# EAGLE design ABMS - VFG - POWER (EAGLE 5.10)
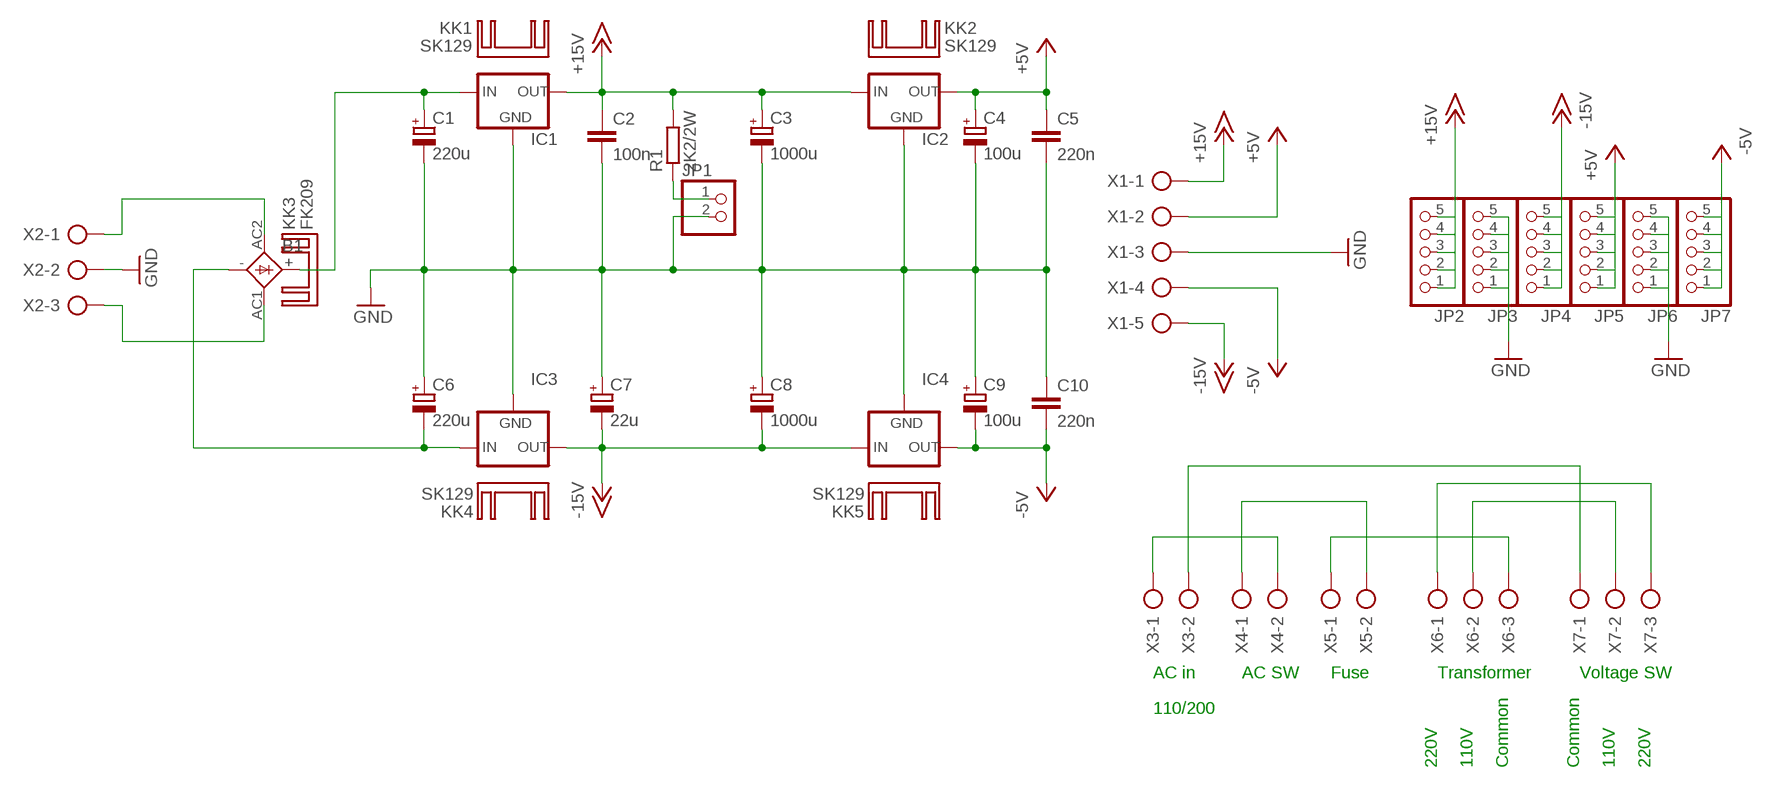
[diagram p0: schematic, sheet 1]

## Parts
B1  GBU4  [GBU4S]
C1  220u  CPOL-EUE5-8.5  [E5-8,5]
C2  100n  C-EU075-032X103  [C075-032X103]
C3  1000u  CPOL-EUE10-20  [EB20D]
C4  100u  CPOL-EUE5-8.5  [E5-8,5]
C5  220n  C-EU075-032X103  [C075-032X103]
C6  220u  CPOL-EUE5-8.5  [E5-8,5]
C7  22u  CPOL-EUE5-8.5  [E5-8,5]
C8  1000u  CPOL-EUE10-20  [EB20D]
C9  100u  CPOL-EUE5-8.5  [E5-8,5]
C10  220n  C-EU075-032X103  [C075-032X103]
IC1  78XXS  [78XXS]
IC2  78XXS  [78XXS]
IC3  79XXS  [79XXS]
IC4  79XXS  [79XXS]
JP1  PINHD-1X2  [1X02]
JP2  PINHD-1X5  [1X05]
JP3  PINHD-1X5  [1X05]
JP4  PINHD-1X5  [1X05]
JP5  PINHD-1X5  [1X05]
JP6  PINHD-1X5  [1X05]
JP7  PINHD-1X5  [1X05]
KK1  SK129  [SK129-HOLE]
KK2  SK129  [SK129-HOLE]
KK3  FK209  [FK209]
KK4  SK129  [SK129-HOLE]
KK5  SK129  [SK129-HOLE]
R1  2K2/2W  R-EU_0207/10  [0207/10]
X1  AK300/5  [AK300/5]
X2  AK300/3  [AK300/3]
X3  AK300/2  [AK300/2]
X4  AK300/2  [AK300/2]
X5  AK300/2  [AK300/2]
X6  AK300/3  [AK300/3]
X7  AK300/3  [AK300/3]

## Nets
+5V: C4.+ C5.1 IC2.OUT JP5.1 JP5.2 JP5.3 JP5.4 JP5.5 X1.2
+15V: C2.1 C3.+ IC1.OUT IC2.IN JP2.1 JP2.2 JP2.3 JP2.4 JP2.5 R1.2 X1.1
-5V: C9.- C10.2 IC4.OUT JP7.1 JP7.2 JP7.3 JP7.4 JP7.5 X1.4
-15V: C7.- C8.- IC3.OUT IC4.IN JP4.1 JP4.2 JP4.3 JP4.4 JP4.5 X1.5
GND: C1.- C2.2 C3.- C4.- C5.2 C6.+ C7.+ C8.+ C9.+ C10.1 IC1.GND IC2.GND IC3.GND IC4.GND JP1.2 JP3.1 JP3.2 JP3.3 JP3.4 JP3.5 JP6.1 JP6.2 JP6.3 JP6.4 JP6.5 X1.3 X2.2
N$1: B1.AC2(AC1) X2.1
N$2: B1.AC1(AC2) X2.3
N$3: B1.+ C1.+ IC1.IN
N$4: B1.- C6.- IC3.IN
N$5: X3.1 X4.2
N$6: X4.1 X5.2
N$7: X5.1 X6.3
N$8: X3.2 X7.1
N$9: X6.1 X7.3
N$10: X6.2 X7.2
N$12: JP1.1 R1.1

## Notes on the sheet
- AC in | AC SW | Fuse | Transformer | Voltage SW
- 110/200
- 220V | 110V | Common | Common | 110V | 220V

## Library data of the parts
B1 = rectifier:GBU4: GENERAL INSTRUMENT RECTIFIER
C1 C3 C4 C6-C9 = resistor:CPOL-EU: POLARIZED CAPACITOR, European symbol
C2 C5 C10 = resistor:C-EU: CAPACITOR, European symbol
IC1 IC2 = v-reg:78XXS: VOLTAGE REGULATOR
IC3 IC4 = v-reg:79XXS: VOLTAGE REGULATOR
JP1 = pinhead:PINHD-1X2: PIN HEADER
JP2-JP7 = pinhead:PINHD-1X5: PIN HEADER
KK1 KK2 KK4 KK5 = heatsink:SK129: HEATSINK manufacturer Fischer/distributor Buerklin
KK3 = heatsink:FK209: HEATSINK manufacturer Fischer/distributor Buerklin
R1 = resistor:R-EU_: RESISTOR, European symbol
X1 = con-ptr500:AK300/5: CONNECTOR
X2 X6 X7 = con-ptr500:AK300/3: CONNECTOR
X3-X5 = con-ptr500:AK300/2: CONNECTOR

## Net classes
0 default: width 0.635 mm, drill 0.889 mm, clearance 0.635 mm

## Board
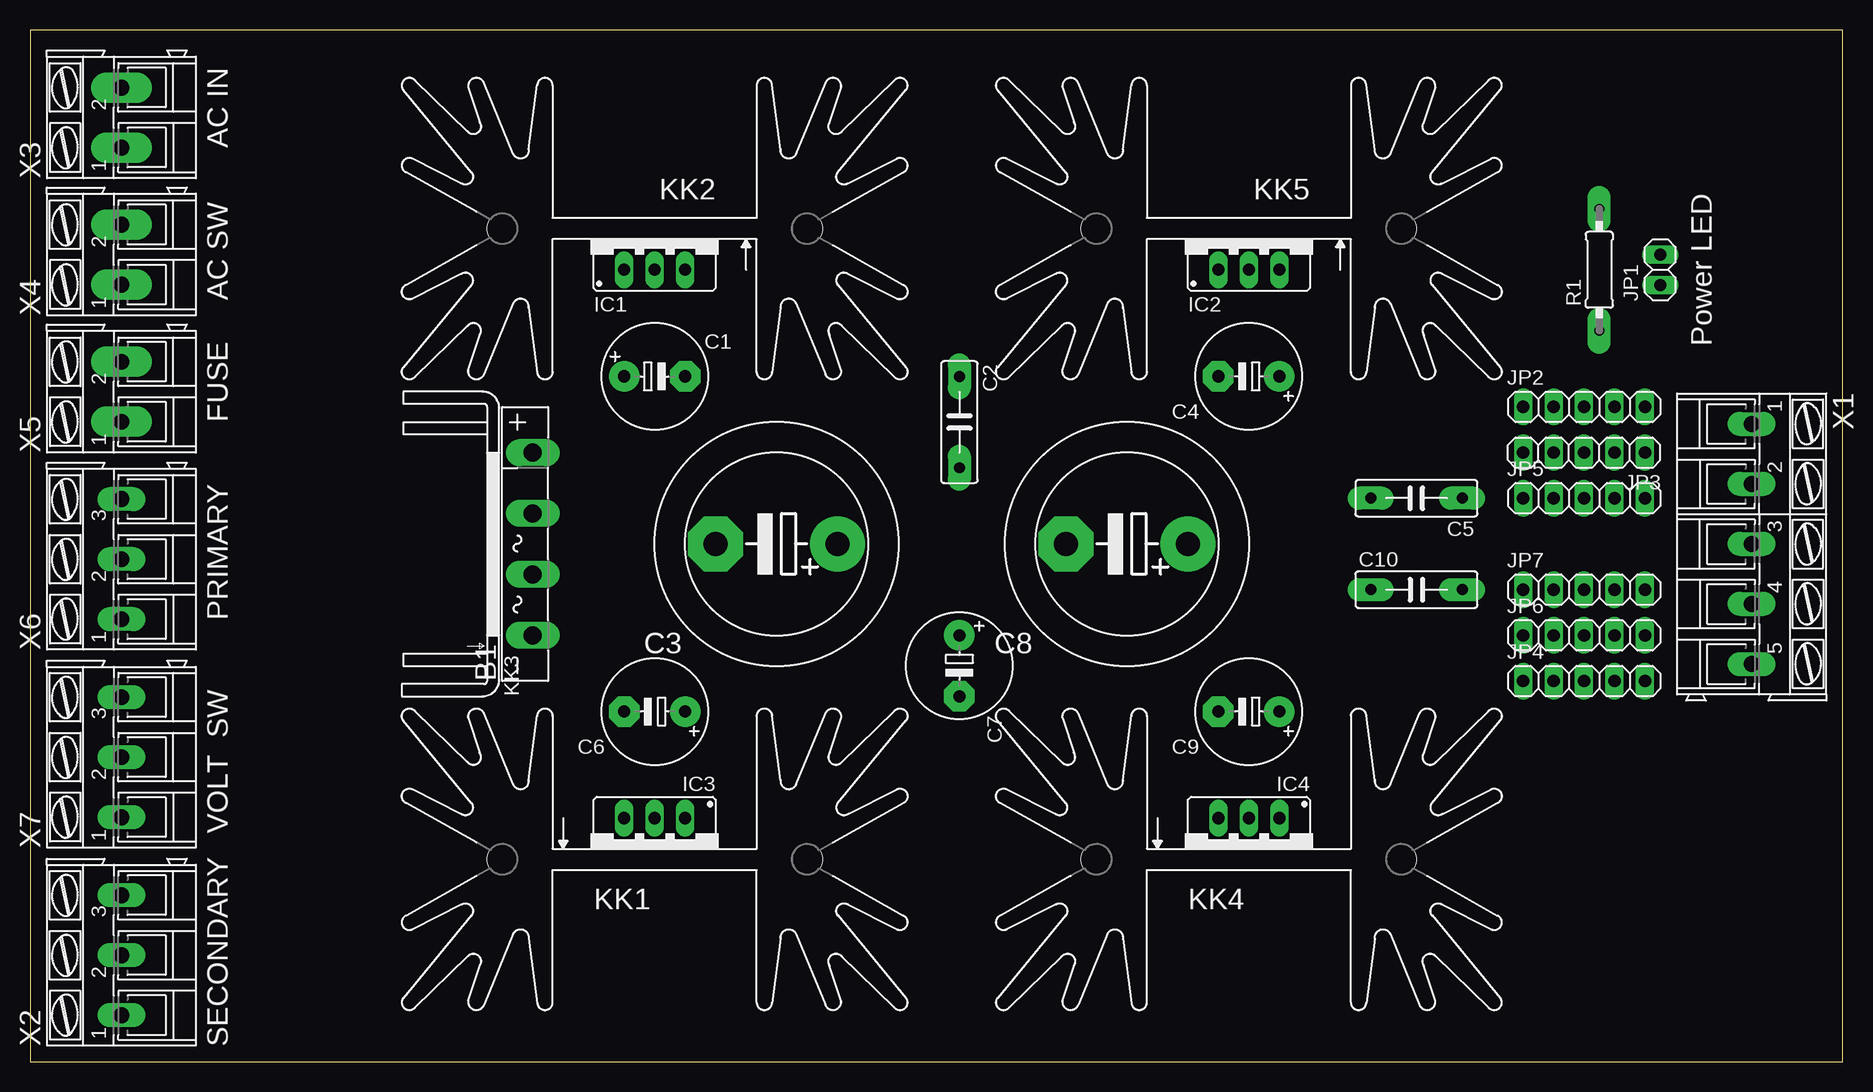
[diagram p1: board, top side]
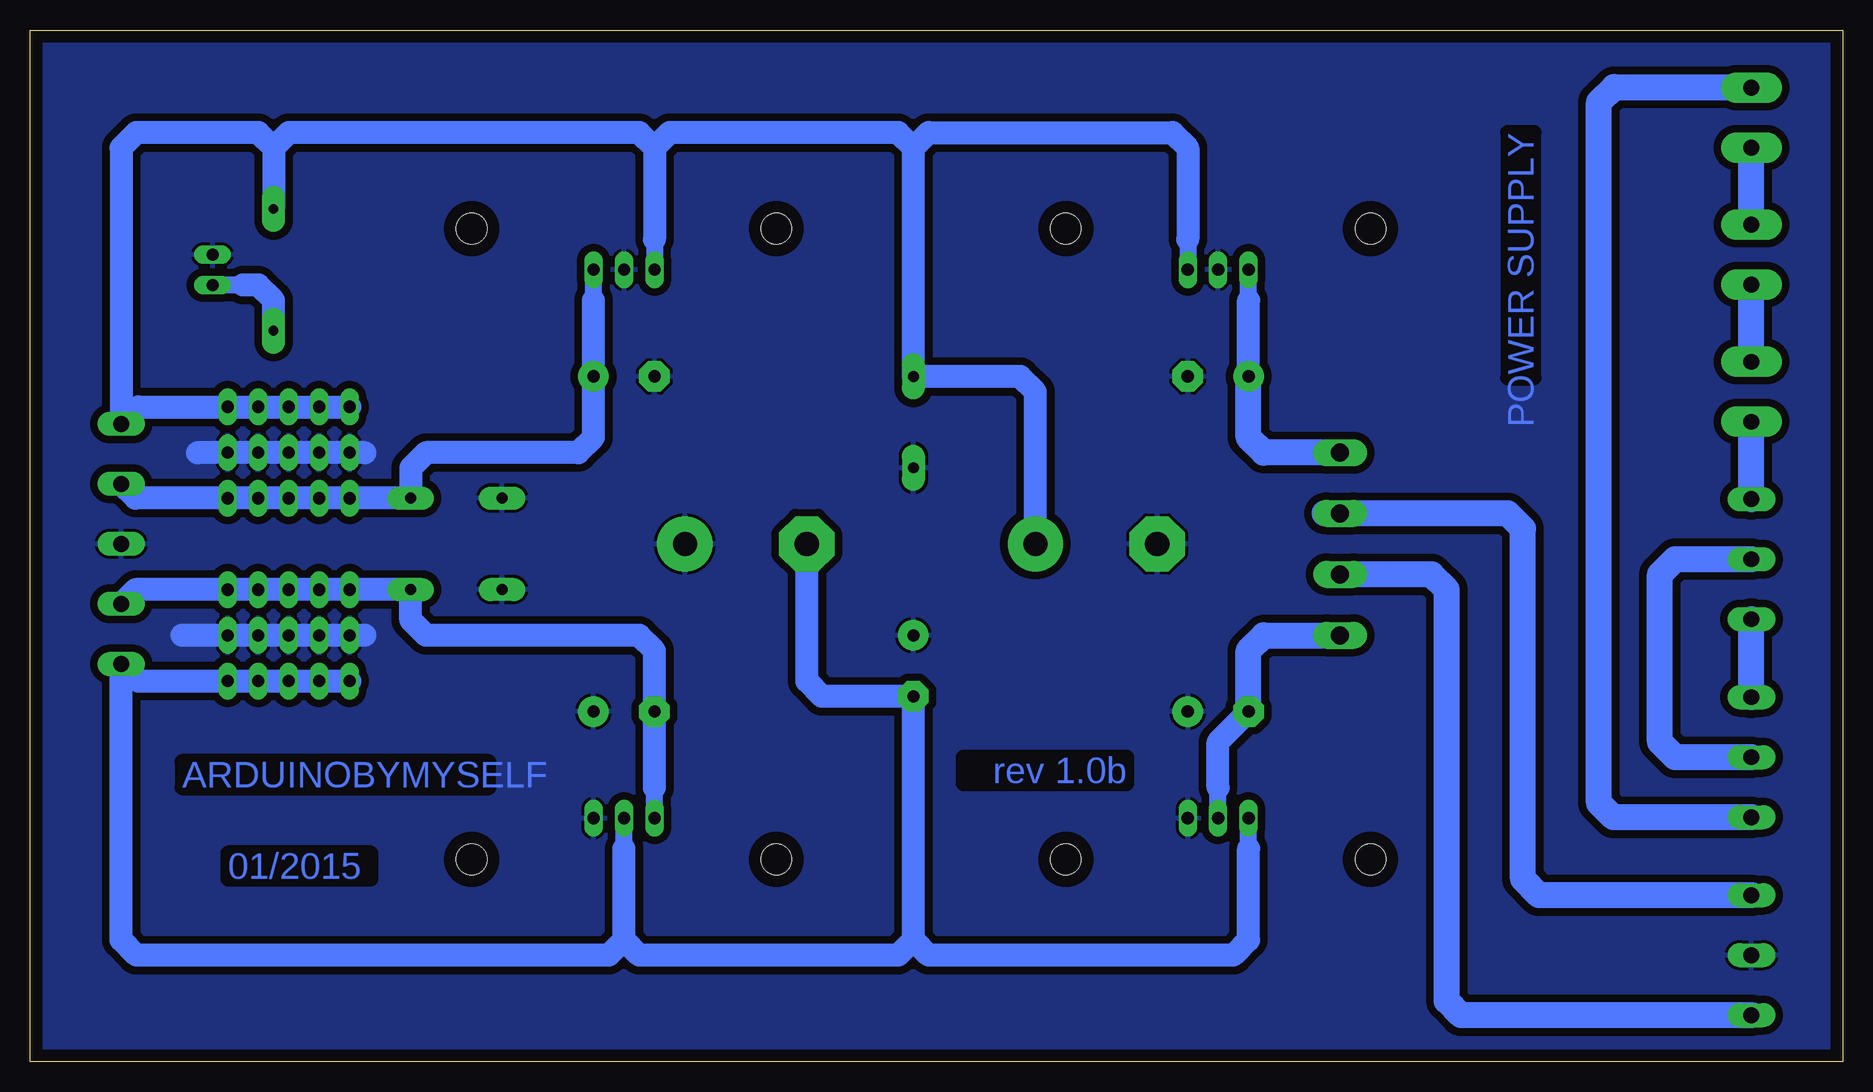
[diagram p2: board, bottom side, seen from below]

Size 151.11 x 86.03 mm. Coordinates in mm from the lower left corner, seen from the top.
Outline: 0,0 151.11,0 151.11,86.03 0,86.03 0,0
Copper layers (1*16): Top 0.035mm / dielectric 1.5mm / Bottom 0.035mm
Design rules "default": minimum track width 10mil, minimum drill 24mil, track to track 8mil, track to pad 8mil, pad to pad 8mil, via to via 8mil, smd to smd 8mil, copper to edge 40mil, drill to drill 8mil, minimum pad ring 10mil, minimum via ring 8mil, stop-mask expansion 4mil, vias tented up to drill 0mil, thermal gap 10mil

### Footprints (pad centres in the part's own frame; a part is rotated, then mirrored left to right if it is on the bottom)
GBU4S = drill 1.499 long: + 7.62,0; - -7.62,0; AC1 2.54,0; AC2 -2.54,0
E5-8,5 = drill 1.016 pad 2.54 round: + -2.54,0 | drill 1.016 pad 2.54 octagon: - 2.54,0
C075-032X103 = drill 0.914 pad 1.93 long: 1 -3.81,0; 2 3.81,0
EB20D = drill 2.007 pad 4.597 round: + -5.08,0 | drill 2.007 pad 4.597 octagon: - 5.08,0
78XXS = drill 1.016 long: GND 0,-2.54; IN -2.54,-2.54; OUT 2.54,-2.54
79XXS = drill 1.016 long: GND -2.54,-2.54; IN 0,-2.54; OUT 2.54,-2.54
1X02 = drill 1.016 long: 1 -1.27,0; 2 1.27,0
1X05 = drill 1.016 long: 1 -5.08,0; 2 -2.54,0; 3 0,0; 4 2.54,0; 5 5.08,0
SK129-HOLE = hole 2.54: -12.7,-0.889; 12.7,-0.889
0207/10 = drill 0.813 pad 1.93 long: 1 -5.08,0; 2 5.08,0
AK300/5 = drill 1.321 long: 1 -10.008,0; 2 -5.004,0; 3 0,0; 4 5.004,0; 5 10.008,0
AK300/3 = drill 1.321 long: 1 -5.004,0; 2 0,0; 3 5.004,0
AK300/2 = drill 1.321 pad 2.54 long: 1 -2.515,0; 2 2.489,0

### Placement (x,y rotation side)
B1  41.91,43.18 90 top
C1  52.07,57.15 0 top
C2  77.47,53.34 270 top
C3  62.23,43.18 180 top
C4  101.6,57.15 180 top
C5  115.57,46.99 180 top
C6  52.07,29.21 180 top
C7  77.47,33.02 270 top
C8  91.44,43.18 180 top
C9  101.6,29.21 180 top
C10  115.57,39.37 0 top
IC1  52.07,68.58 0 top
IC2  101.6,68.58 0 top
IC3  52.07,17.78 180 top
IC4  101.6,17.78 180 top
JP1  135.89,66.04 90 top
JP2  129.54,54.61 0 top
JP3  129.54,50.8 180 top
JP4  129.54,31.75 0 top
JP5  129.54,46.99 0 top
JP6  129.54,35.56 0 top
JP7  129.54,39.37 0 top
KK1  52.07,17.78 0 top
KK2  52.07,68.58 180 top
KK3  38.1,43.18 90 top
KK4  101.6,17.78 0 top
KK5  101.6,68.58 180 top
R1  130.81,66.04 90 top
X1  143.51,43.18 270 top
X2  7.62,8.89 90 top
X3  7.62,78.74 90 top
X4  7.62,67.31 90 top
X5  7.62,55.88 90 top
X6  7.62,41.91 90 top
X7  7.62,25.4 90 top

### Tracks (layer width: path | path; a pad name or v marks a point on that pad's centre or on a via)
+5V
  Bottom 1.422: 104.14,63.5 IC2.OUT
  Bottom 1.93: X1.2 142.32,46.99 JP5.5 JP5.4 JP5.3 JP5.2 JP5.1 C5.1 119.38,49.53 118.11,50.8 105.41,50.8 104.14,52.07 C4.+ 104.14,63.5
+15V
  Bottom 1.422: 99.06,68.58 IC2.IN | 54.61,68.58 IC1.OUT
  Bottom 1.93: JP2.1 JP2.2 JP2.3 JP2.4 JP2.5 142.09,54.61 X1.1 143.51,76.2 142.24,77.47 132.08,77.47 130.81,76.2 | 77.47,76.2 76.2,77.47 55.88,77.47 54.61,76.2 54.61,68.58 | 77.47,76.2 78.74,77.47 97.79,77.47 99.06,76.2 | 99.06,76.2 100.33,77.47 129.54,77.47 130.81,76.2 | 99.06,76.2 99.06,68.58 | 130.81,76.2 R1.2 | 67.31,46.99 C3.+ 67.31,55.88 68.58,57.15 C2.1 77.47,76.2
-5V
  Bottom 1.422: IC4.OUT 99.06,22.86
  Bottom 1.93: X1.4 142.32,39.37 JP7.5 JP7.4 JP7.3 JP7.2 JP7.1 C10.2 119.38,36.83 118.11,35.56 100.33,35.56 99.06,34.29 C9.- 99.06,22.86
-15V
  Bottom 1.422: 49.53,17.78 IC3.OUT | 101.6,17.78 IC4.IN
  Bottom 1.93: JP4.1 JP4.2 JP4.3 JP4.4 JP4.5 142.09,31.75 X1.5 143.51,10.16 142.24,8.89 102.87,8.89 101.6,10.16 | 77.47,10.16 76.2,8.89 50.8,8.89 49.53,10.16 49.53,17.78 | 77.47,10.16 78.74,8.89 100.33,8.89 101.6,10.16 | 101.6,10.16 101.6,17.78 | 77.47,10.16 C7.- 85.09,30.48 86.36,31.75 C8.-
GND
  Bottom 1.93: 138.43,35.56 JP6.5 JP6.4 JP6.3 JP6.2 JP6.1 123.19,35.56 | 123.19,50.8 JP3.5 JP3.4 JP3.3 JP3.2 JP3.1 137.16,50.8
  pour Bottom: -1.27,87.63 152.4,87.63 152.4,-1.27 -1.27,-1.27
N$1
  Bottom 2.184: X2.1 31.83,3.89 33.02,5.08 33.02,39.37 34.29,40.64 B1.AC2
N$2
  Bottom 2.184: X2.3 25.32,13.89 26.67,15.24 26.67,44.45 27.94,45.72 B1.AC1 43.18,45.72
N$3
  Bottom 1.422: 49.53,63.5 IC1.IN
  Bottom 1.93: C1.+ 49.53,63.5
  Bottom 2.184: B1.+ 48.26,50.8 49.53,52.07 C1.+
N$4
  Bottom 1.422: IC3.IN 52.07,22.86
  Bottom 1.93: C6.- 52.07,26.67 52.07,22.86
  Bottom 2.184: B1.- 48.26,35.56 49.53,34.29 C6.-
N$5
  Bottom 2.184: X4.2 X3.1
N$6
  Bottom 2.184: X5.2 X4.1
N$7
  Bottom 2.184: X6.3 X5.1
N$8
  Bottom 2.184: X7.1 19.13,20.4 20.32,21.59 20.32,80.01 19.05,81.28 7.67,81.28 X3.2
N$9
  Bottom 2.184: X7.3 X6.1
N$10
  Bottom 2.184: X7.2 13.97,25.4 15.24,26.67 15.24,40.64 13.97,41.91 X6.2
N$12
  Bottom 1.422: 133.35,64.77 JP1.1
  Bottom 1.93: R1.1 130.81,63.5 132.08,64.77 133.35,64.77

### Text on the board
Bottom: POWER SUPPLY | rev 1.0b | ARDUINOBYMYSELF | 01/2015
tNames: AC IN | Power LED | AC SW | FUSE | PRIMARY | VOLT SW | SECONDARY